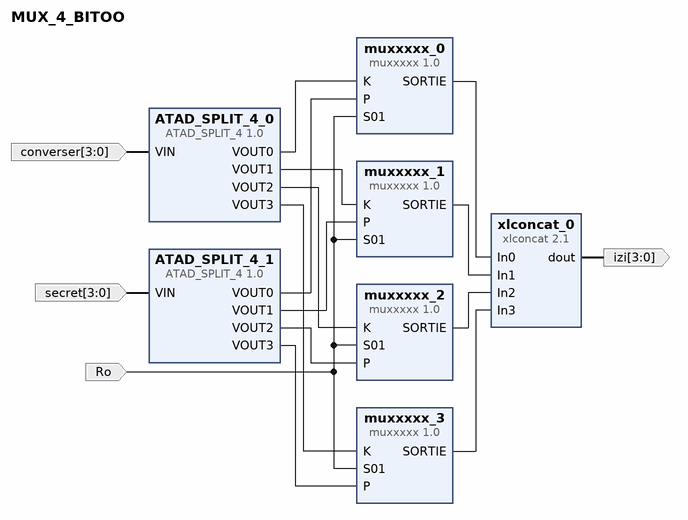
[diagram p0: block diagram of the top level]
# Vivado block design MUX_4_BITOO, xc7a100tcsg324-1, Vivado 2018.3
create_bd_design MUX_4_BITOO

create_bd_port -dir I -from 3 -to 0 converser
create_bd_port -dir I -from 3 -to 0 secret
create_bd_port -dir I Ro
create_bd_port -dir O -from 3 -to 0 izi

create_bd_cell -type ip -vlnv polymtl.ca:user:muxxxxx:1.0 muxxxxx_0
create_bd_cell -type ip -vlnv xilinx.com:user:ATAD_SPLIT_4:1.0 ATAD_SPLIT_4_0
create_bd_cell -type ip -vlnv xilinx.com:user:ATAD_SPLIT_4:1.0 ATAD_SPLIT_4_1
create_bd_cell -type ip -vlnv polymtl.ca:user:muxxxxx:1.0 muxxxxx_1
create_bd_cell -type ip -vlnv polymtl.ca:user:muxxxxx:1.0 muxxxxx_2
create_bd_cell -type ip -vlnv polymtl.ca:user:muxxxxx:1.0 muxxxxx_3
create_bd_cell -type ip -vlnv xilinx.com:ip:xlconcat:2.1 xlconcat_0
set_property -dict {CONFIG.NUM_PORTS 4} [get_bd_cells xlconcat_0]

# ---- connections ----

connect_bd_net [get_bd_pins muxxxxx_0/SORTIE] [get_bd_pins xlconcat_0/In0]
connect_bd_net [get_bd_pins muxxxxx_1/SORTIE] [get_bd_pins xlconcat_0/In1]
connect_bd_net [get_bd_pins muxxxxx_2/SORTIE] [get_bd_pins xlconcat_0/In2]
connect_bd_net [get_bd_pins muxxxxx_3/SORTIE] [get_bd_pins xlconcat_0/In3]
connect_bd_net [get_bd_ports Ro] [get_bd_pins muxxxxx_0/S01] [get_bd_pins muxxxxx_1/S01] [get_bd_pins muxxxxx_2/S01] [get_bd_pins muxxxxx_3/S01]
connect_bd_net [get_bd_ports converser] [get_bd_pins ATAD_SPLIT_4_0/VIN]
connect_bd_net [get_bd_ports secret] [get_bd_pins ATAD_SPLIT_4_1/VIN]
connect_bd_net [get_bd_pins ATAD_SPLIT_4_0/VOUT0] [get_bd_pins muxxxxx_0/K]
connect_bd_net [get_bd_pins ATAD_SPLIT_4_1/VOUT0] [get_bd_pins muxxxxx_0/P]
connect_bd_net [get_bd_pins ATAD_SPLIT_4_0/VOUT1] [get_bd_pins muxxxxx_1/K]
connect_bd_net [get_bd_pins ATAD_SPLIT_4_0/VOUT2] [get_bd_pins muxxxxx_2/K]
connect_bd_net [get_bd_pins ATAD_SPLIT_4_0/VOUT3] [get_bd_pins muxxxxx_3/K]
connect_bd_net [get_bd_pins ATAD_SPLIT_4_1/VOUT1] [get_bd_pins muxxxxx_1/P]
connect_bd_net [get_bd_pins ATAD_SPLIT_4_1/VOUT2] [get_bd_pins muxxxxx_2/P]
connect_bd_net [get_bd_pins ATAD_SPLIT_4_1/VOUT3] [get_bd_pins muxxxxx_3/P]
connect_bd_net [get_bd_pins xlconcat_0/dout] [get_bd_ports izi]

validate_bd_design
save_bd_design
